# Altium schematic sheet MCU.SchDoc
size Letter; DrawnBy: Titan Yuan; SheetNumber: 7; SheetTotal: 8
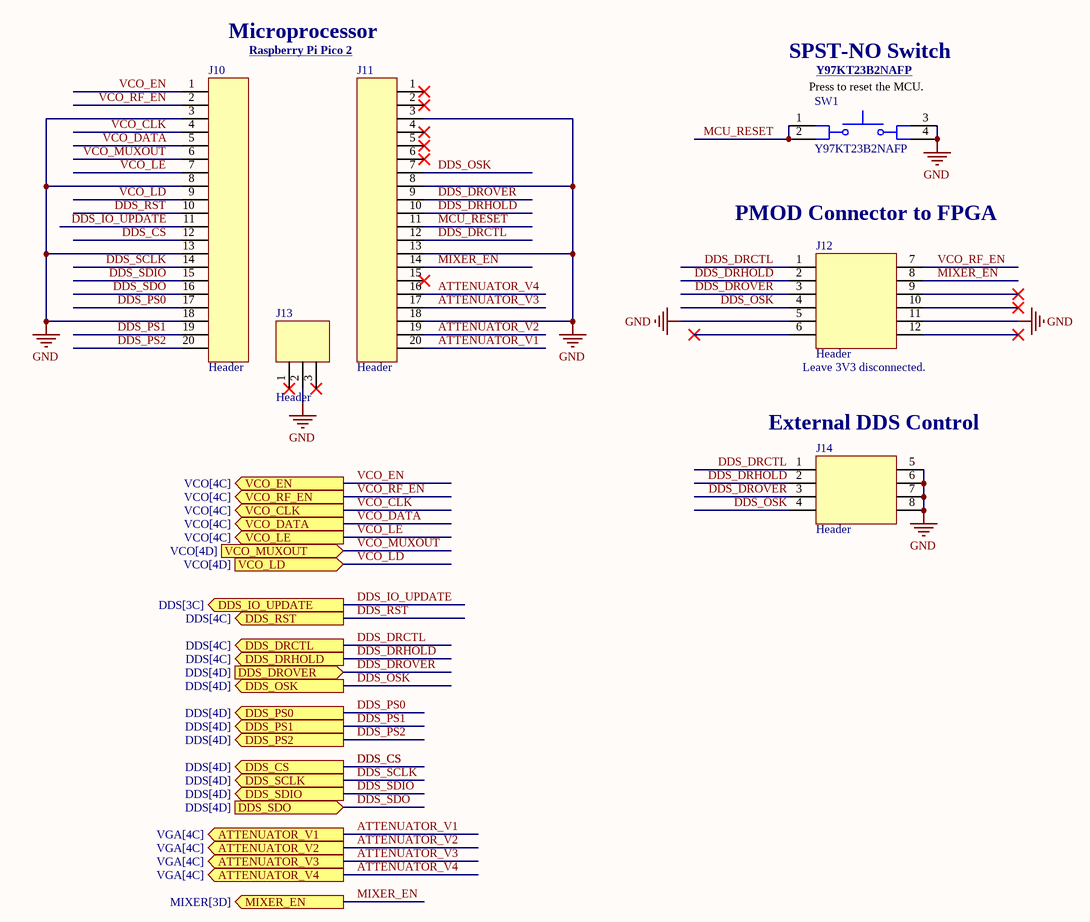
[diagram p0: MCU.SchDoc]

## Parts
J10  Header  [CONN_1x20_2.54mm_PinSocket_Vertical]
J11  Header  [CONN_1x20_2.54mm_PinSocket_Vertical]
J12  Header  [CONN_2x6_2.54mm_PinHeader_Horizontal]
J13  Header  [CONN_1x3_2.54mm_PinSocket_Vertical]
J14  Header  [CONN_2x4_2.54mm_PinHeader_Vertical]
SW1  Y97KT23B2NAFP  [PTS647]

## Ports
ATTENUATOR_V1 (out, see VGA[4C]), ATTENUATOR_V2 (out, see VGA[4C]), ATTENUATOR_V3 (out, see VGA[4C]), ATTENUATOR_V4 (out, see VGA[4C]), DDS_CS (out, see DDS[4D]), DDS_DRCTL (out, see DDS[4C]), DDS_DRHOLD (out, see DDS[4C]), DDS_DROVER (in, see DDS[4D]), DDS_IO_UPDATE (out, see DDS[3C]), DDS_OSK (out, see DDS[4D]), DDS_PS0 (out, see DDS[4D]), DDS_PS1 (out, see DDS[4D]), DDS_PS2 (out, see DDS[4D]), DDS_RST (out, see DDS[4C]), DDS_SCLK (out, see DDS[4D]), DDS_SDIO (out, see DDS[4D]), DDS_SDO (in, see DDS[4D]), MIXER_EN (out, see MIXER[3D]), VCO_CLK (out, see VCO[4C]), VCO_DATA (out, see VCO[4C]), VCO_EN (out, see VCO[4C]), VCO_LD (in, see VCO[4D]), VCO_LE (out, see VCO[4C]), VCO_MUXOUT (in, see VCO[4D]), VCO_RF_EN (out, see VCO[4C])

## Nets
GND: J10.3 J10.8 J10.13 J10.18 J11.3 J11.8 J11.13 J11.18 J12.5 J12.11 J13.2 J14.5 J14.6 J14.7 J14.8 SW1.3 SW1.4
ATTENUATOR_V1: J11.20 ; port ATTENUATOR_V1
ATTENUATOR_V2: J11.19 ; port ATTENUATOR_V2
ATTENUATOR_V3: J11.17 ; port ATTENUATOR_V3
ATTENUATOR_V4: J11.16 ; port ATTENUATOR_V4
DDS_CS: J10.12 ; port DDS_CS
DDS_DRCTL: J11.12 J12.1 J14.1 ; port DDS_DRCTL
DDS_DRHOLD: J11.10 J12.2 J14.2 ; port DDS_DRHOLD
DDS_DROVER: J11.9 J12.3 J14.3 ; port DDS_DROVER
DDS_IO_UPDATE: J10.11 ; port DDS_IO_UPDATE
DDS_OSK: J11.7 J12.4 J14.4 ; port DDS_OSK
DDS_PS0: J10.17 ; port DDS_PS0
DDS_PS1: J10.19 ; port DDS_PS1
DDS_PS2: J10.20 ; port DDS_PS2
DDS_RST: J10.10 ; port DDS_RST
DDS_SCLK: J10.14 ; port DDS_SCLK
DDS_SDIO: J10.15 ; port DDS_SDIO
DDS_SDO: J10.16 ; port DDS_SDO
MCU_RESET: J11.11 SW1.1 SW1.2
MIXER_EN: J11.14 J12.8 ; port MIXER_EN
VCO_CLK: J10.4 ; port VCO_CLK
VCO_DATA: J10.5 ; port VCO_DATA
VCO_EN: J10.1 ; port VCO_EN
VCO_LD: J10.9 ; port VCO_LD
VCO_LE: J10.7 ; port VCO_LE
VCO_MUXOUT: J10.6 ; port VCO_MUXOUT
VCO_RF_EN: J10.2 J12.7 ; port VCO_RF_EN

Not connected (* = marked no-connect by the designer): J11 1* 2* 4* 5* 6* 15*; J12 6* 9* 10* 12*; J13 1* 3*

## Notes on the sheet
- Microprocessor
- Raspberry Pi Pico 2 <https://www.raspberrypi.com/products/raspberry-pi-pico-2/>
- SPST-NO Switch
- (near SW1) Press to reset the MCU.
- (near SW1) Y97KT23B2NAFP <https://www.ckswitches.com/media/2567/pts647.pdf>
- PMOD Connector to FPGA
- (near J12) Leave 3V3 disconnected.
- (near J14) External DDS Control

## Library data of the parts
J10 J11 = CONN_1x20_2.54mm_PinSocket_Vertical: WR-PHD 2.54 mm Socket Header; 20 pins; Manufacturer: Wurth Elektronik; Manufacturer Part Number: 61302011821; Contact Resistance: 20mΩ; Current Rating: 3A; Gender: Female; Insulation Resistance: 1GΩ; Operating Supply Voltage: 250V; Pitch: 2.54mm; Supplier: DigiKey; Supplier Part Number: 732-61302011821-ND; RoHS: Compliant; Category: Connectors; Stock: 9205; Pricing: 1=0.83, 25=0.7508, 100=0.7038, 250=0.6534, 500=0.6048, 1000=0.5058 (USD); Contact Plating: Gold; Insulation Material: PBT; Lead Pitch: 2.54mm; Length: 51.3mm; Max Operating Temperature: 105°C; Min Operating Temperature: -40°C; Pins: 20; Orientation: Vertical; ComponentLink1URL: https://datasheet.octopart.com:443/61302011821-Wurth-Elektronik-datasheet-182028588.pdf?src-supplier=Wurth+Elektronik; ComponentLink1Description: https://datasheet.octopart.com:443/61302011821-Wurth-Elektronik-datasheet-182028588.pdf?src-supplier=Wurth+Elektronik; ComponentLink2URL: https://datasheet.octopart.com:443/61302011821-W%C3%BCrth-Elektronik-datasheet-62127820.pdf?src-supplier=Wurth+Elektronik; ComponentLink2Description: https://datasheet.octopart.com:443/61302011821-W%C3%BCrth-Elektronik-datasheet-62127820.pdf?src-supplier=Wurth+Elektronik; ComponentLink3URL: https://datasheet.octopart.com:443/61302011821-W%C3%BCrth-Elektronik-datasheet-149524182.pdf?src-supplier=Farnell; ComponentLink3Description: https://datasheet.octopart.com:443/61302011821-W%C3%BCrth-Elektronik-datasheet-149524182.pdf?src-supplier=Farnell
J12 = CONN_2x6_2.54mm_PinHeader_Horizontal: Conn Unshrouded Header HDR 12 POS 2.54mm Solder RA Top Entry Thru-Hole Bag; Manufacturer: Adam Tech; Manufacturer Part Number: PH2RA-12-UA; Contact Resistance: 20mΩ; Current Rating: 3A; Insulation Resistance: 5GΩ; Supplier: DigiKey; Supplier Part Number: 2057-PH2RA-12-UA-ND; RoHS: Compliant; Category: Card Edge Connectors; Stock: 5214; Pricing: 1=0.27, 10=0.229, 100=0.1945, 500=0.17358, 1000=0.16528, 5000=0.14753, 10000=0.14049 (USD); Contact Gender: Male; Contact Material: Brass; Export Control Classification Number (ECCN) Code: EAR99; Harmonized Tariff Schedule (HTS) Code: 8536.69.40.40; Introduction Date: 2012-01-13; Lifecycle Status: Production; Max Operating Temperature: 105°C; Min Operating Temperature: -40°C; Pins: 12; Number of Rows: 2; REACH SVHC: Yes; Row Spacing: 2.54mm; Schedule B: 8536694040, 8536694040|8536694040|8536694040|8536694040|8536694040; Terminal Pitch: 2.54mm; ComponentLink1URL: https://datasheet.octopart.com:443/PH2RA-12-UA-Adam-Tech-datasheet-21182894.pdf?src-supplier=IHS; ComponentLink1Description: https://datasheet.octopart.com:443/PH2RA-12-UA-Adam-Tech-datasheet-21182894.pdf?src-supplier=IHS; ComponentLink2URL: http://sigma.octopart.com:80/reach_statement/Adam-Tech-company-23.pdf?src-supplier=Compliance+Statements; ComponentLink2Description: http://sigma.octopart.com:80/reach_statement/Adam-Tech-company-23.pdf?src-supplier=Compliance+Statements; ComponentLink3URL: http://sigma.octopart.com:80/rohs_statement/Adam-Tech-company-22.pdf?src-supplier=Compliance+Statements; ComponentLink3Description: http://sigma.octopart.com:80/rohs_statement/Adam-Tech-company-22.pdf?src-supplier=Compliance+Statements
J13 = CONN_1x3_2.54mm_PinSocket_Vertical: Connector Header Through Hole 3 position 0.100" (2.54mm)-FAN Control Connector; Manufacturer: Wurth Elektronik; Manufacturer Part Number: 61300311821; Manufacturer Lifecycle Status: ACTIVE; Contact Resistance: 20mΩ; Current Rating: 3A; Gender: Female; Insulation Resistance: 1GΩ; Operating Supply Voltage: 250V; YEOL: 1 = Estimated lifetime > 10 years; Supplier: DigiKey; Supplier Part Number: 732-61300311821-ND; RoHS: Compliant; Category: Uncategorized; Stock: 1715; Pricing: 1=0.32, 10=0.303, 100=0.2916, 250=0.27992, 500=0.2673 (USD); Contact Plating: Gold; Insulation Material: PBT; Lead Pitch: 2.54mm; Length: 8.12mm; Max Operating Temperature: 105°C; Min Operating Temperature: -40°C; Pins: 3; Orientation: Vertical; Pitch: 2.54mm; ComponentLink1URL: https://datasheet.octopart.com:443/61300311821-Wurth-Elektronik-datasheet-182028583.pdf?src-supplier=Wurth+Elektronik; ComponentLink1Description: https://datasheet.octopart.com:443/61300311821-Wurth-Elektronik-datasheet-182028583.pdf?src-supplier=Wurth+Elektronik; ComponentLink2URL: https://datasheet.octopart.com:443/61300311821-W%C3%BCrth-Elektronik-datasheet-62127820.pdf?src-supplier=Wurth+Elektronik; ComponentLink2Description: https://datasheet.octopart.com:443/61300311821-W%C3%BCrth-Elektronik-datasheet-62127820.pdf?src-supplier=Wurth+Elektronik; Lifecycle Status: Production
J14 = CONN_2x4_2.54mm_PinHeader_Vertical: Pin Header, Board-to-Board, 2.54 mm, 2 Rows, 8 Contacts, Through Hole, TSW Series; Manufacturer: Samtec; Manufacturer Part Number: TSW-104-07-F-D; Manufacturer Lifecycle Status: PRODUCTION; Connector Type: Male Pin; Gender: Male; Max Current Rating: 7.6A; Max Voltage Rating (AC): 550V; Number of Contacts: 8; Pitch: 2.54mm; Supplier: DigiKey; Supplier Part Number: SAM8996-ND; RoHS: Compliant; Category: Headers and Wire Housings; Stock: 16994; Pricing: 1=0.43, 250=0.37, 500=0.308, 1000=0.263, 2500=0.218, 5000=0.19, 10000=0.167, 25000=0.146 (USD); Color: Black; Contact Material: Bronze; Contact Mating Length: 5.842mm; Contact Plating: Gold; Depth: 5.08mm; Housing Color: Black; Housing Material: Polyester; Lead Pitch: 2.54mm; Length: 10.16mm; Lifecycle Status: Production; Max Operating Temperature: 125°C; Min Operating Temperature: -55°C; Mounting Technology: Through Hole; Number of Positions: 8; Number of Rows: 2; Orientation: Straight; Radiation Hardening: No; REACH SVHC: No; Row Spacing: 2.54mm; Termination: Solder; ComponentLink1URL: https://datasheet.octopart.com:443/TSW-104-07-F-D-Samtec-datasheet-97325576.pdf?src-supplier=Sager+Electronics; ComponentLink1Description: https://datasheet.octopart.com:443/TSW-104-07-F-D-Samtec-datasheet-97325576.pdf?src-supplier=Sager+Electronics; ComponentLink2URL: https://datasheet.octopart.com:443/TSW-104-07-F-D-Samtec-datasheet-151455181.pdf?src-supplier=Sager+Electronics; ComponentLink2Description: https://datasheet.octopart.com:443/TSW-104-07-F-D-Samtec-datasheet-151455181.pdf?src-supplier=Sager+Electronics; ComponentLink3URL: https://sigma.octopart.com:443/97325577/technical_drawing/Samtec-TSW-104-07-F-D.pdf?src-supplier=HQonline; ComponentLink3Description: https://sigma.octopart.com:443/97325577/technical_drawing/Samtec-TSW-104-07-F-D.pdf?src-supplier=HQonline; ComponentLink4URL: https://datasheet.octopart.com:443/TSW-104-07-F-D-Samtec-datasheet-136646178.pdf?src-supplier=Master+Electronics; ComponentLink4Description: https://datasheet.octopart.com:443/TSW-104-07-F-D-Samtec-datasheet-136646178.pdf?src-supplier=Master+Electronics; ComponentLink5URL: https://datasheet.octopart.com:443/TSW-104-07-F-D-Samtec-datasheet-182948906.pdf?src-supplier=JRH+Electronics; ComponentLink5Description: https://datasheet.octopart.com:443/TSW-104-07-F-D-Samtec-datasheet-182948906.pdf?src-supplier=JRH+Electronics; ComponentLink6URL: https://datasheet.octopart.com:443/TSW-104-07-F-D-Samtec-datasheet-160657603.pdf?src-supplier=Toby+Electronics; ComponentLink6Description: https://datasheet.octopart.com:443/TSW-104-07-F-D-Samtec-datasheet-160657603.pdf?src-supplier=Toby+Electronics; ComponentLink7URL: https://datasheet.octopart.com:443/TSW-104-07-F-D-Samtec-datasheet-116539033.pdf?src-supplier=Toby+Electronics; ComponentLink7Description: https://datasheet.octopart.com:443/TSW-104-07-F-D-Samtec-datasheet-116539033.pdf?src-supplier=Toby+Electronics; ComponentLink8URL: https://datasheet.octopart.com:443/TSW-104-07-F-D-Samtec-datasheet-116536310.pdf?src-supplier=Toby+Electronics; ComponentLink8Description: https://datasheet.octopart.com:443/TSW-104-07-F-D-Samtec-datasheet-116536310.pdf?src-supplier=Toby+Electronics; ComponentLink9URL: https://datasheet.octopart.com:443/TSW-104-07-F-D-Samtec-datasheet-116615235.pdf?src-supplier=Electro+Sonic; ComponentLink9Description: https://datasheet.octopart.com:443/TSW-104-07-F-D-Samtec-datasheet-116615235.pdf?src-supplier=Electro+Sonic; ComponentLink10URL: https://datasheet.octopart.com/TSW-104-07-F-D-Samtec-datasheet-86818365.pdf; ComponentLink10Description: https://datasheet.octopart.com/TSW-104-07-F-D-Samtec-datasheet-86818365.pdf; ComponentLink11URL: https://datasheet.octopart.com:443/TSW-104-07-F-D-Samtec-datasheet-62107121.pdf?src-supplier=Newark; ComponentLink11Description: https://datasheet.octopart.com:443/TSW-104-07-F-D-Samtec-datasheet-62107121.pdf?src-supplier=Newark; ComponentLink12URL: https://datasheet.octopart.com:443/TSW-104-07-F-D-Samtec-datasheet-11047283.pdf?src-supplier=Newark; ComponentLink12Description: https://datasheet.octopart.com:443/TSW-104-07-F-D-Samtec-datasheet-11047283.pdf?src-supplier=Newark
SW1 = Y97KT23B2NAFP: Switch Tactile OFF Mom SPST Round Button Gull Wing 50mA 12VDC 100000Cycles 1.77N Surface Mount T/R; Manufacturer: C&K; Bounce Time: <=5 ms; Contact Resistance: 100 mΩ; Electrical Life: 100kcycles; Max Voltage Rating (DC): 12V; Number of Positions: 1; Operating Force: 2.26N; Manufacturer Part Number: Y97KT23B2NAFP; Maximum Voltage: 12 VDC; Maximum Current: 50 mA; Insulation Resistance: 100 MΩ; Supplier: DigiKey; Supplier Part Number: 108-PTS647SM38SMTR2LFSCT-ND; RoHS: Compliant; Category: Tactile Switches; Stock: 37245; Pricing: 1=0.26, 10=0.226, 25=0.2116, 100=0.1897, 250=0.17588, 500=0.16596, 1000=0.15666 (USD); Contact Current Rating: 50mA; Country of Origin: Mainland China; Export Control Classification Number (ECCN) Code: EAR99; Height: 2.9mm; Harmonized Tariff Schedule (HTS) Code: 8536.50.90.40; Introduction Date: 2019-06-11; Length: 4.5mm; Life (Cycles): 100kcycles; Lifecycle Status: Production; Max Current Rating: 50mA; Max Operating Temperature: 70°C; Min Operating Temperature: -40°C; Mounting Technology: Surface Mount; REACH SVHC: Yes; Schedule B: 8536509065, 8536509065|8536509065, 8536509065|8536509065|8536509065, 8536509065|8536509065|8536509065|8536509065; Throw Configuration: SPST; Voltage Rating (DC): 12V; ComponentLink1URL: https://datasheet.octopart.com:443/PTS647SM38SMTR2LFS-C%26K-Components-datasheet-180017464.pdf?src-supplier=IHS; ComponentLink1Description: https://datasheet.octopart.com:443/PTS647SM38SMTR2LFS-C%26K-Components-datasheet-180017464.pdf?src-supplier=IHS; ComponentLink2URL: https://datasheet.octopart.com:443/PTS647SM38SMTR2LFS-C%26K-Components-datasheet-117317067.pdf?src-supplier=Future+Electronics; ComponentLink2Description: https://datasheet.octopart.com:443/PTS647SM38SMTR2LFS-C%26K-Components-datasheet-117317067.pdf?src-supplier=Future+Electronics; ComponentLink3URL: https://datasheet.octopart.com:443/PTS647SM38SMTR2-LFS-C%26K-Components-datasheet-175422368.pdf?src-supplier=Farnell; ComponentLink3Description: https://datasheet.octopart.com:443/PTS647SM38SMTR2-LFS-C%26K-Components-datasheet-175422368.pdf?src-supplier=Farnell; ComponentLink4URL: https://datasheet.octopart.com:443/PTS647SM38SMTR2LFS-C%26K-Components-datasheet-145017121.pdf?src-supplier=Electro+Sonic; ComponentLink4Description: https://datasheet.octopart.com:443/PTS647SM38SMTR2LFS-C%26K-Components-datasheet-145017121.pdf?src-supplier=Electro+Sonic; ComponentLink5URL: https://datasheet.octopart.com:443/PTS-647-SM38-SMTR2-LFS-C%26K-Components-datasheet-119449707.pdf?src-supplier=RS+(Formerly+Allied+Electronics); ComponentLink5Description: https://datasheet.octopart.com:443/PTS-647-SM38-SMTR2-LFS-C%26K-Components-datasheet-119449707.pdf?src-supplier=RS+(Formerly+Allied+Electronics)